# EAGLE design isp_breadboard_adapter (EAGLE 5.06)
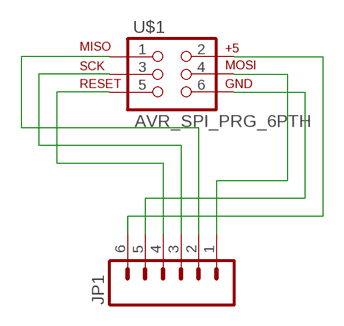
[diagram p0: schematic, sheet 1]

## Parts
JP1  M06SIP  [1X06]
U$1  AVR_SPI_PRG_6PTH  [2X3]

## Nets
+5V: JP1.6 U$1.2
GND: JP1.5 U$1.6
MISO: JP1.2 U$1.1
MOSI: JP1.1 U$1.4
RESET: JP1.4 U$1.5
SCK: JP1.3 U$1.3

## Library data of the parts
JP1 = SparkFun:M06: Header 6 Standard 6-pin 0.1" header. Use with straight break away headers (SKU : PRT-00116), right angle break away headers (PRT-00553), swiss pins (PRT-00743), machine pins (PRT-00117), and female headers (PRT-00115). Molex polarized connector foot print use with SKU : PRT-08094 with associated crimp pins and housings. NOTES ON THE VARIANTS LOCK and LOCK_LONGPADS... This footprint was designed to help hold the alignment of a through-hole component (i.e. 6-pin header) while soldering it into place. You may notice that each hole has been shifted either up or down by 0.005 of an inch from it's more standard position (which is a perfectly straight line). This slight alteration caused the pins (the squares in the middle) to touch the edges of the holes. Because they are alternating, it causes a "brace" to hold the component in place. 0.005 has proven to be the perfect amount of "off-center" position when using our standard breakaway headers. Although looks a little odd when you look at the bare footprint, once you have a header in there, the alteration is very hard to notice. Also, if you push a header all the way into place, it is covered up entirely on the bottom side. This idea of altering the position of holes to aid alignment will be further integrated into the Sparkfun Library for other footprints. It can help hold any component with 3 or more connection pins.
U$1 = SparkFun:AVR_SPI_PRG_6: AVR ISP 6 Pin This is the reduced ISP connector for AVR programming. Common on Arduino. This footprint will take up less PCB space and can be used with a 10-pin to 6-pin adapter such as SKU: BOB-08508

## Board
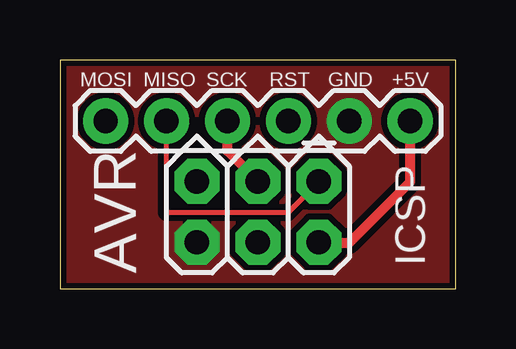
[diagram p1: board, top side]
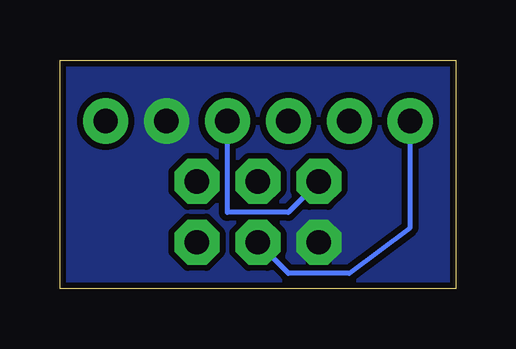
[diagram p2: board, bottom side, seen from below]

Size 16.51 x 9.52 mm. Coordinates in mm from the lower left corner, seen from the top.
Outline: 0,0 16.51,0 16.51,9.52 0,9.52 0,0
Copper layers (1*16): Top 0.035mm / dielectric 1.5mm / Bottom 0.035mm
Design rules "SparkFun *": minimum track width 8mil, minimum drill 20mil, track to track 8mil, track to pad 8mil, pad to pad 8mil, via to via 8mil, smd to smd 8mil, copper to edge 10mil, drill to drill 8mil, minimum pad ring 12mil, minimum via ring 10mil, stop-mask expansion 4mil, vias tented up to drill 25mil, thermal gap 0mil

### Footprints (pad centres in the part's own frame; a part is rotated, then mirrored left to right if it is on the bottom)
1X06 = drill 1.016 pad 1.88 round: 1 0,0; 2 2.54,0; 3 5.08,0; 4 7.62,0; 5 10.16,0; 6 12.7,0
2X3 = drill 1.016 pad 1.88 octagon: 1 0,0; 2 0,2.54; 3 2.54,0; 4 2.54,2.54; 5 5.08,0; 6 5.08,2.54

### Placement (x,y rotation side)
JP1  1.91,6.99 0 top
U$1  10.79,4.47 180 top

### Tracks (layer width: path | path; a pad name or v marks a point on that pad's centre or on a via)
+5V
  Top 0.406: JP1.6 14.61,4.45 12.06,1.91 10.82,1.91 U$1.2
GND
  pour Bottom (isolate 0.254): 0,9.52 16.51,9.52 16.51,0 0,0
  pour Top (isolate 0.254): 0,9.52 16.51,9.52 16.51,0 0,0
MISO
  Top 0.203: JP1.2 4.45,3.17 9.53,3.17 U$1.1
MOSI
  Bottom 0.203: JP1.1 1.91,2.54 4.45,0.64 6.99,0.64 U$1.4
RESET
  Bottom 0.203: JP1.4 9.53,4.45 9.53,3.17 6.99,3.17 U$1.5
SCK
  Top 0.406: JP1.3 6.99,5.74 U$1.3

### Text on the board
tPlace: MOSI | MISO | SCK | RST | GND | +5V | AVR | ICSP